# Altium project RetroPie-CM3.PrjPcb
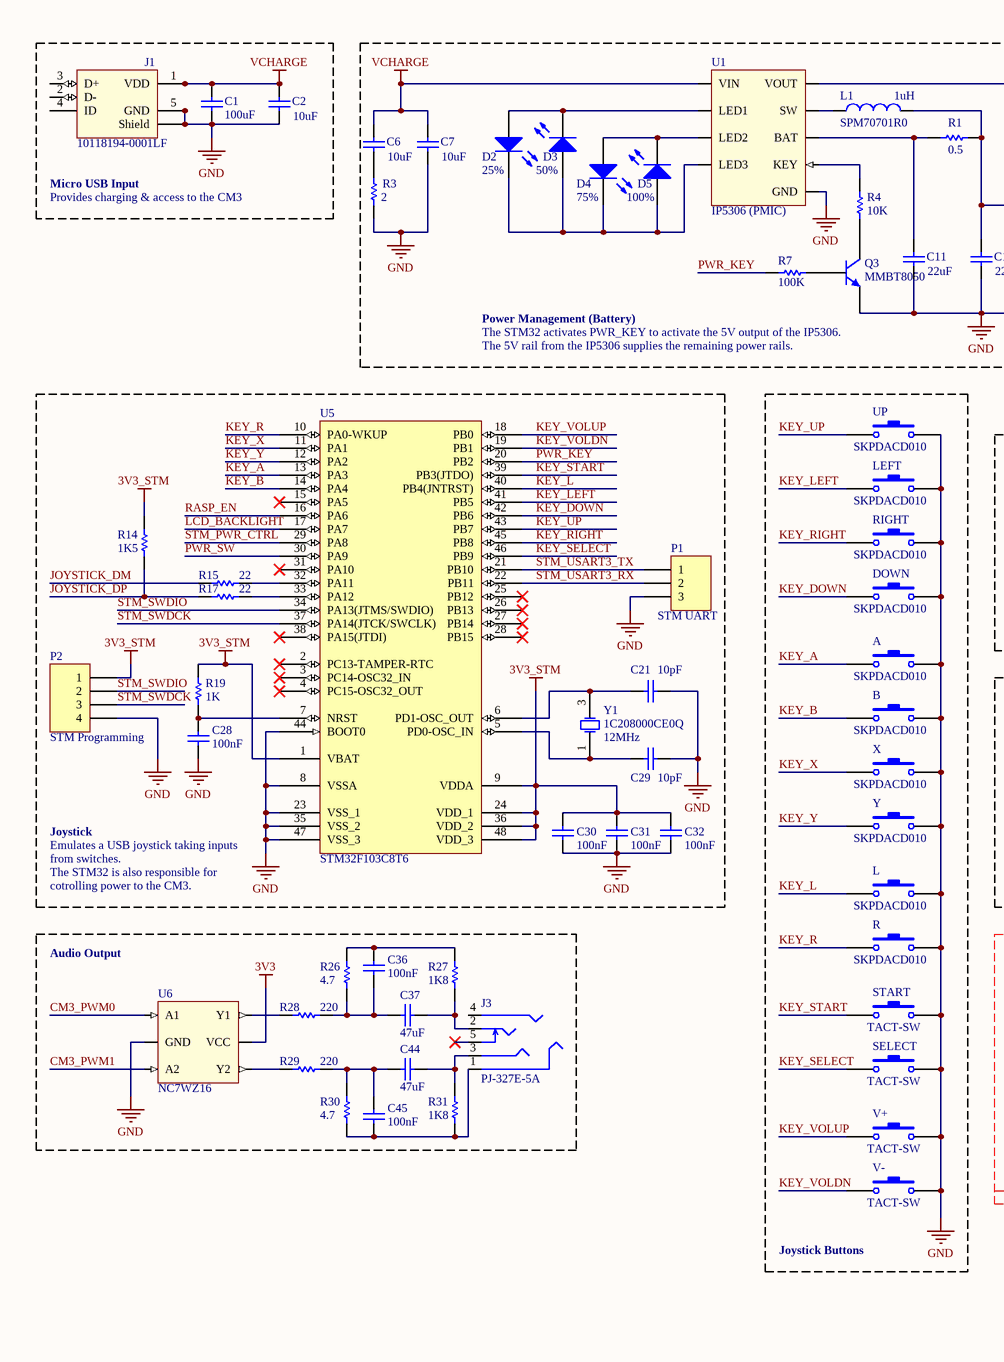
[diagram p0: RetroPie-CM3.SchDoc, left]
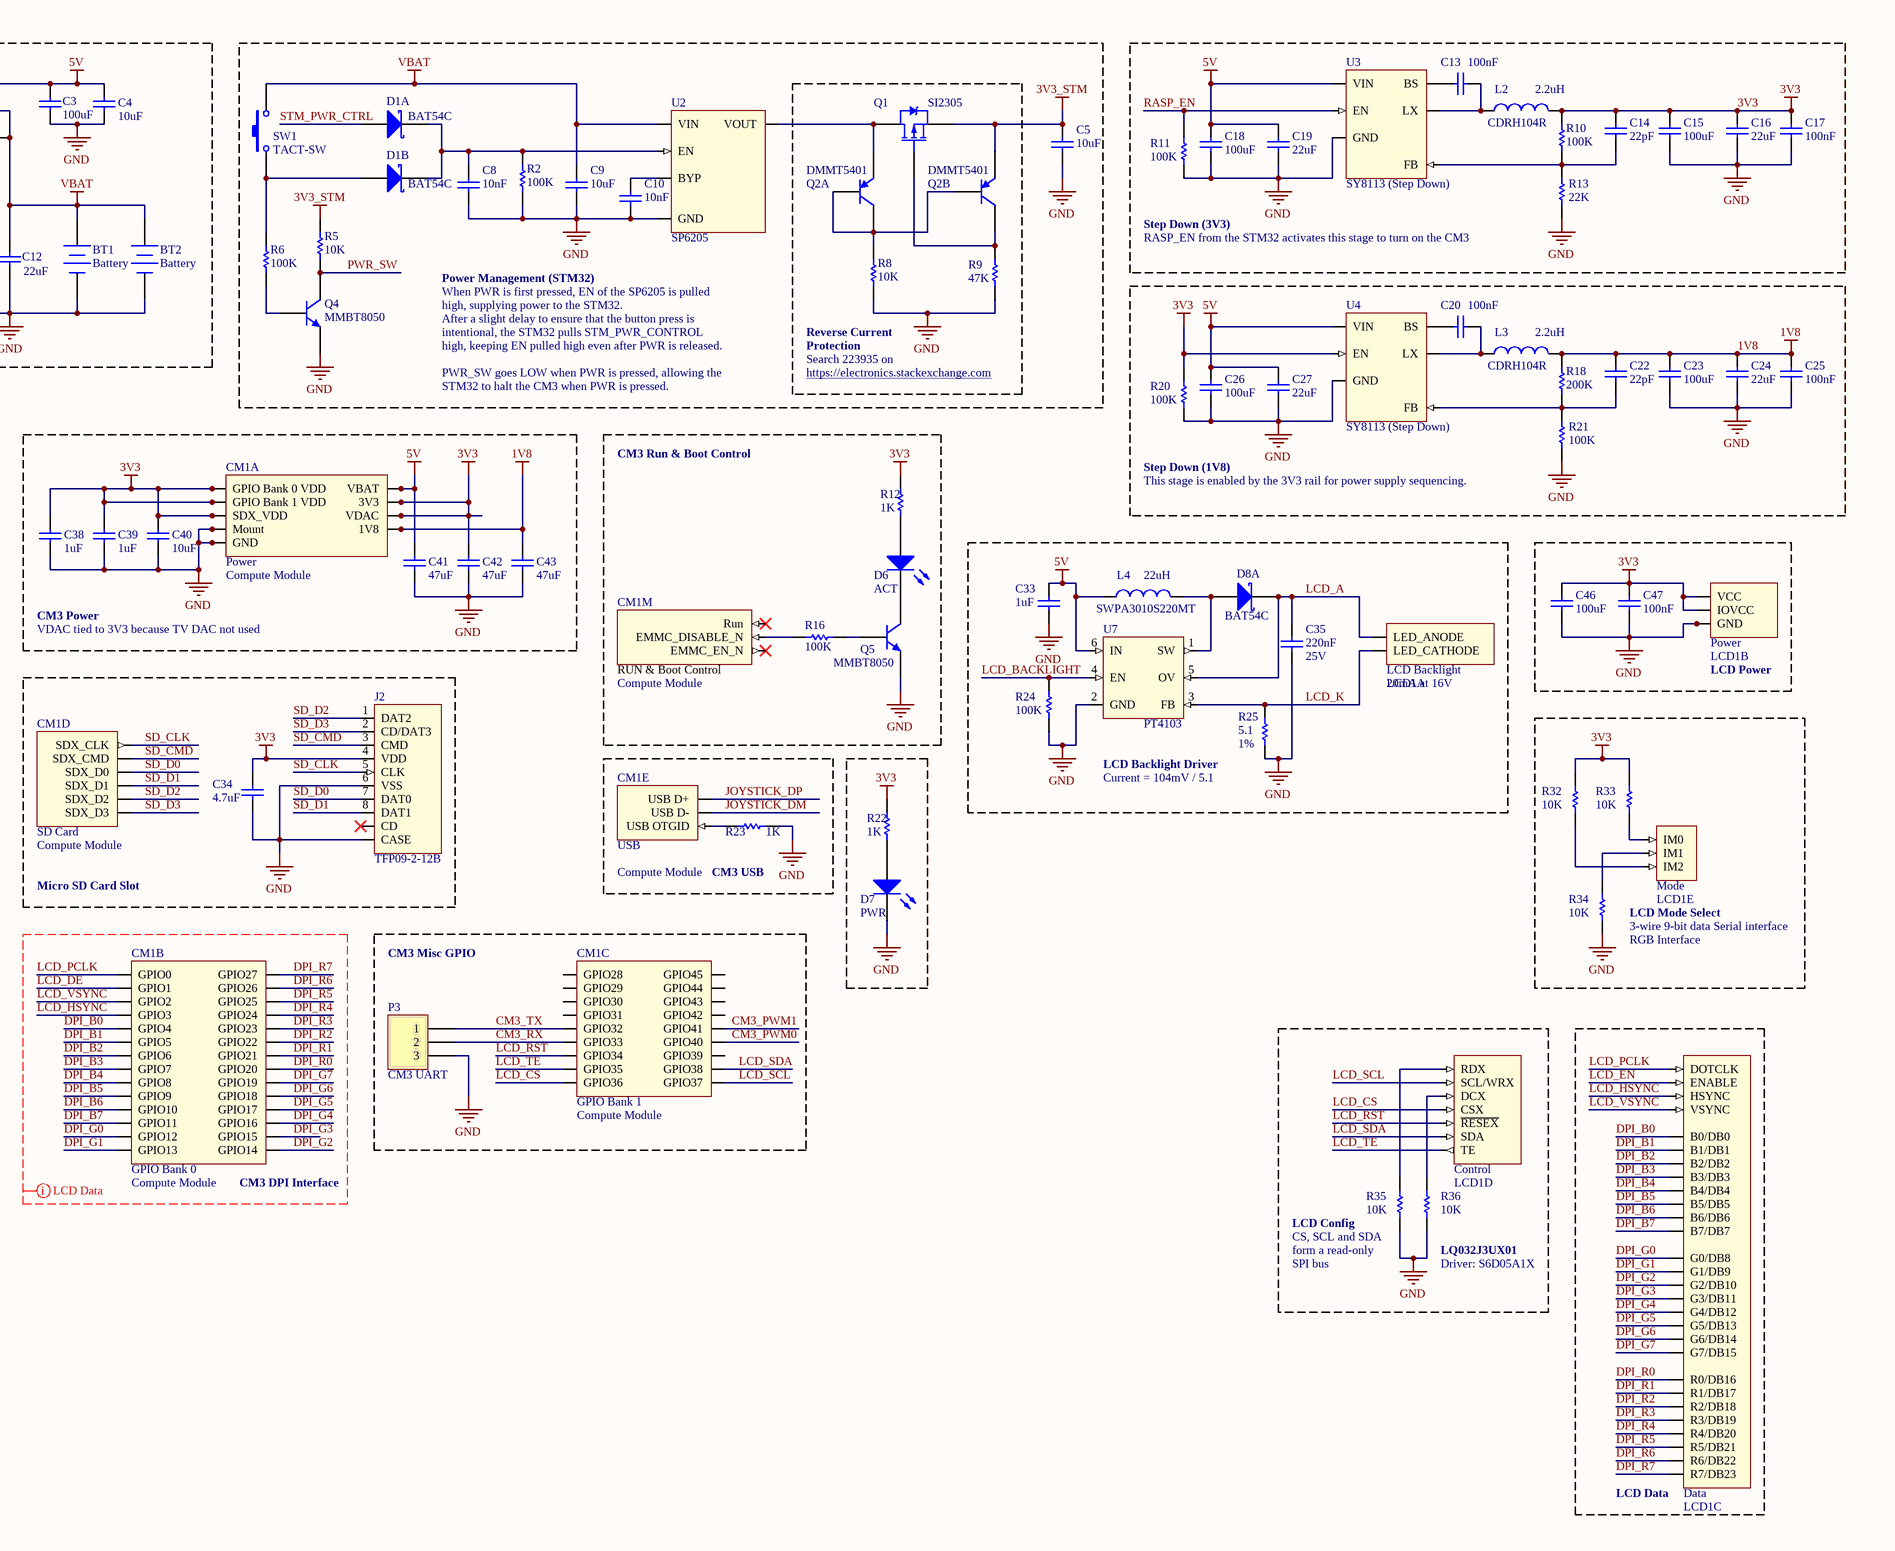
[diagram p1: RetroPie-CM3.SchDoc, right]
1 sheet, 133 parts. Net scope: global (net labels, ports and power ports of the same name join across sheets).

## Sheet RetroPie-CM3.SchDoc
size A2

### Parts
A  SKPDACD010  [ALPS_8X8X5.5]
B  SKPDACD010  [ALPS_8X8X5.5]
BT1  Battery  [BAT-2]
BT2  Battery  [BAT-2]
C1  value 100uF  [C1210_N]  (hidden comment: Cap)
C2  value 10uF  [J1-0603]  (hidden comment: Cap)
C3  value 100uF  [C1210_N]  (hidden comment: Cap)
C4  value 10uF  [J1-0603]  (hidden comment: Cap)
C5  value 10uF  [J1-0603]  (hidden comment: Cap)
C6  value 10uF  [J1-0603]  (hidden comment: Cap)
C7  value 10uF  [J1-0603]  (hidden comment: Cap)
C8  value 10nF  [J1-0603]  (hidden comment: Cap)
C9  value 10uF  [J1-0603]  (hidden comment: Cap)
C10  value 10nF  [J1-0603]  (hidden comment: Cap)
C11  value 22uF  [6-0805_N]  (hidden comment: Cap)
C12  value 22uF  [6-0805_N]  (hidden comment: Cap)
C13  value 100nF  [J1-0603]  (hidden comment: Cap)
C14  value 22pF  [6-0805_N]  (hidden comment: Cap)
C15  value 100uF  [C1210_N]  (hidden comment: Cap)
C16  value 22uF  [6-0805_N]  (hidden comment: Cap)
C17  value 100nF  [J1-0603]  (hidden comment: Cap)
C18  value 100uF  [C1210_N]  (hidden comment: Cap)
C19  value 22uF  [6-0805_N]  (hidden comment: Cap)
C20  value 100nF  [J1-0603]  (hidden comment: Cap)
C21  value 10pF  [J1-0603]  (hidden comment: Cap)
C22  value 22pF  [6-0805_N]  (hidden comment: Cap)
C23  value 100uF  [C1210_N]  (hidden comment: Cap)
C24  value 22uF  [6-0805_N]  (hidden comment: Cap)
C25  value 100nF  [J1-0603]  (hidden comment: Cap)
C26  value 100uF  [C1210_N]  (hidden comment: Cap)
C27  value 22uF  [6-0805_N]  (hidden comment: Cap)
C28  value 100nF  [J1-0603]  (hidden comment: Cap)
C29  value 10pF  [J1-0603]  (hidden comment: Cap)
C30  value 100nF  [J1-0603]  (hidden comment: Cap)
C31  value 100nF  [J1-0603]  (hidden comment: Cap)
C32  value 100nF  [J1-0603]  (hidden comment: Cap)
C33  value 1uF  [6-0805_N]  (hidden comment: Cap)
C34  value 4.7uF  [6-0805_N]  (hidden comment: Cap)
C35  value 220nF  Voltage: 25V  [6-0805_N]  (hidden comment: Cap)
C36  value 100nF  [J1-0603]  (hidden comment: Cap)
C37  value 47uF  [6-0805_N]  (hidden comment: Cap)
C38  value 1uF  [6-0805_N]  (hidden comment: Cap)
C39  value 1uF  [6-0805_N]  (hidden comment: Cap)
C40  value 10uF  [J1-0603]  (hidden comment: Cap)
C41  value 47uF  [6-0805_N]  (hidden comment: Cap)
C42  value 47uF  [6-0805_N]  (hidden comment: Cap)
C43  value 47uF  [6-0805_N]  (hidden comment: Cap)
C44  value 47uF  [6-0805_N]  (hidden comment: Cap)
C45  value 100nF  [J1-0603]  (hidden comment: Cap)
C46  value 100uF  [C1210_N]  (hidden comment: Cap)
C47  value 100nF  [J1-0603]  (hidden comment: Cap)
CM1  Compute Module  [1473005-4]  (parts A,B,C,D,E,M of 13)
D1  BAT54C  [SOT23-3N]  (parts A,B of 2)
D2  25%  [0603-LED]
D3  50%  [0603-LED]
D4  75%  [0603-LED]
D5  100%  [0603-LED]
D6  ACT  [0603-LED]
D7  PWR  [0603-LED]
D8  BAT54C  [SOT23-3N]  (part A of 2)
DOWN  SKPDACD010  [ALPS_8X8X5.5]
J1  10118194-0001LF  [10103594-0001LF]
J2  TFP09-2-12B  [TFP-09-2-12B]
J3  PJ-327E-5A  [PJ-327E]
L  SKPDACD010  [ALPS_8X8X5.5-SIDE]
L1  SPM70701R0  value 1uH  [0402-A]
L2  CDRH104R  value 2.2uH  [Generic Inductor]
L3  CDRH104R  value 2.2uH  [Generic Inductor]
L4  SWPA3010S220MT  value 22uH  [0402-A]
LCD1  LQ032J3UX01  [LQ032J3UX01]  (value not drawn)  (parts A,B,C,D,E of 5)
LEFT  SKPDACD010  [ALPS_8X8X5.5]
P1  STM UART  [HDR1X3]
P2  STM Programming  [HDR1X4]
P3  CM3 UART  [HDR1X3]
Q1  SI2305  [SOT23-3N]
Q2  DMMT5401  [SOT26A-6L]  (parts A,B of 2)
Q3  MMBT8050  [SOT23-3N]
Q4  MMBT8050  [SOT23-3N]
Q5  MMBT8050  [SOT23-3N]
R  SKPDACD010  [ALPS_8X8X5.5-SIDE]
R1  value 0.5  [1608[0603]]  (hidden comment: Res1)
R2  value 100K  [1608[0603]]  (hidden comment: Res1)
R3  value 2  [1608[0603]]  (hidden comment: Res1)
R4  value 10K  [1608[0603]]  (hidden comment: Res1)
R5  value 10K  [1608[0603]]  (hidden comment: Res1)
R6  value 100K  [1608[0603]]  (hidden comment: Res1)
R7  value 100K  [1608[0603]]  (hidden comment: Res1)
R8  value 10K  [1608[0603]]  (hidden comment: Res1)
R9  value 47K  [1608[0603]]  (hidden comment: Res1)
R10  value 100K  [1608[0603]]  (hidden comment: Res1)
R11  value 100K  [1608[0603]]  (hidden comment: Res1)
R12  value 1K  [1608[0603]]  (hidden comment: Res1)
R13  value 22K  [1608[0603]]  (hidden comment: Res1)
R14  value 1K5  [1608[0603]]  (hidden comment: Res1)
R15  value 22  [1608[0603]]  (hidden comment: Res1)
R16  value 100K  [1608[0603]]  (hidden comment: Res1)
R17  value 22  [1608[0603]]  (hidden comment: Res1)
R18  value 200K  [1608[0603]]  (hidden comment: Res1)
R19  value 1K  [1608[0603]]  (hidden comment: Res1)
R20  value 100K  [1608[0603]]  (hidden comment: Res1)
R21  value 100K  [1608[0603]]  (hidden comment: Res1)
R22  value 1K  [1608[0603]]  (hidden comment: Res1)
R23  value 1K  [1608[0603]]  (hidden comment: Res1)
R24  value 100K  [1608[0603]]  (hidden comment: Res1)
R25  value 5.1  Tolerance: 1%  [1608[0603]]  (hidden comment: Res1)
R26  value 4.7  [1608[0603]]  (hidden comment: Res1)
R27  value 1K8  [1608[0603]]  (hidden comment: Res1)
R28  value 220  [1608[0603]]  (hidden comment: Res1)
R29  value 220  [1608[0603]]  (hidden comment: Res1)
R30  value 4.7  [1608[0603]]  (hidden comment: Res1)
R31  value 1K8  [1608[0603]]  (hidden comment: Res1)
R32  value 10K  [1608[0603]]  (hidden comment: Res1)
R33  value 10K  [1608[0603]]  (hidden comment: Res1)
R34  value 10K  [1608[0603]]  (hidden comment: Res1)
R35  value 10K  [1608[0603]]  (hidden comment: Res1)
R36  value 10K  [1608[0603]]  (hidden comment: Res1)
RIGHT  SKPDACD010  [ALPS_8X8X5.5]
SELECT  TACT-SW  [TACT-SW]
START  TACT-SW  [TACT-SW]
SW1  TACT-SW  [TACT-SW]
U1  IP5306 (PMIC)  [ESOP8]
U2  SP6205  [SOT23-5AL]
U3  SY8113 (Step Down)  [SOT26A-6L]
U4  SY8113 (Step Down)  [SOT26A-6L]
U5  STM32F103C8T6  [SQFP50P900X900-48N]
U6  NC7WZ16  [SC-88]
U7  PT4103  [SOT26A-6L]
UP  SKPDACD010  [ALPS_8X8X5.5]
V+  TACT-SW  [TACT-SW]
V-  TACT-SW  [TACT-SW]
X  SKPDACD010  [ALPS_8X8X5.5]
Y  SKPDACD010  [ALPS_8X8X5.5]
Y1  1C208000CE0Q  Frequency: 12MHz  [3225]

### Blocks framed on the sheet
Power Management (Battery): BT1 BT2 C3 C4 C6 C7 C11 C12 D2-D5 L1 Q3 R1 R3 R4 R7 U1
Step Down (3V3): C13-C19 L2 R10 R11 R13 U3
Step Down (1V8): C20 C22-C27 L3 R18 R20 R21 U4
Joystick Buttons: A B DOWN L LEFT R RIGHT SELECT START UP V+ V- X Y
CM3 Run & Boot Control: CM1 D6 Q5 R12 R16
LCD Power: C46 C47 LCD1
Micro SD Card Slot: C34 CM1 J2
CM3 USB: CM1 R23
Audio Output: C36 C37 C44 C45 J3 R26-R31 U6
CM3 Misc GPIO: CM1 P3
LCD Data: LCD1

### Nets
1V8: C22.1 C23.1 C24.2 C25.1 C43.2 CM1.183(1V8) CM1.184(1V8) CM1.185(1V8) CM1.186(1V8) L3.2 R18.1
3V3: C14.1 C15.1 C16.2 C17.1 C34.2 C38.2 C39.2 C40.2 C42.2 C46.1 C47.1 CM1.4(SDX_VDD) CM1.6(SDX_VDD) CM1.39(GPIO_Bank_0_VDD) CM1.40(GPIO_Bank_0_VDD) CM1.41(GPIO_Bank_1_VDD) CM1.42(GPIO_Bank_1_VDD) CM1.189(VDAC) CM1.190(VDAC) CM1.191(3V3) CM1.192(3V3) CM1.193(3V3) CM1.194(3V3) J2.4(VDD) L2.2 LCD1.4(VCC) LCD1.5(IOVCC) R10.1 R12.2 R20.2 R22.2 R32.1 R33.1 U4.4(EN) U6.5(VCC)
3V3_STM: C5.2 C30.2 C31.2 C32.2 P2.1 Q1.2(S) Q2.5(E) R5.1 R14.1 R19.1 U5.1(VBAT) U5.9(VDDA) U5.24(VDD_1) U5.36(VDD_2) U5.48(VDD_3)
5V: C3.1 C4.2 C18.1 C19.2 C26.1 C27.2 C33.2 C41.2 CM1.197(VBAT) CM1.198(VBAT) CM1.199(VBAT) CM1.200(VBAT) L4.1 U1.8(VOUT) U3.5(VIN) U4.5(VIN) U7.6(IN)
GND: A.2 B.2 BT1.2(-) BT2.2(-) C1.2 C2.1 C3.2 C4.1 C5.1 C7.1 C8.1 C9.1 C10.1 C11.1 C12.1 C15.2 C16.1 C17.2 C18.2 C19.1 C21.1 C23.2 C24.1 C25.2 C26.2 C27.1 C28.1 C29.1 C30.1 C31.1 C32.1 C33.1 C34.1 C35.1 C38.1 C39.1 C40.1 C41.1 C42.1 C43.1 C46.2 C47.2 CM1.1(GND) CM1.7(GND) CM1.8(GND) CM1.13(GND) CM1.14(GND) CM1.19(GND) CM1.20(GND) CM1.25(GND) CM1.26(GND) CM1.31(GND) CM1.32(GND) CM1.37(GND) CM1.38(GND) CM1.43(GND) CM1.44(GND) CM1.49(GND) CM1.50(GND) CM1.55(GND) CM1.56(GND) CM1.61(GND) CM1.62(GND) CM1.67(GND) CM1.68(GND) CM1.73(GND) CM1.74(GND) CM1.79(GND) CM1.80(GND) CM1.85(GND) CM1.86(GND) CM1.91(GND) CM1.92(GND) CM1.97(GND) CM1.98(GND) CM1.103(GND) CM1.104(GND) CM1.109(GND) CM1.110(GND) CM1.115(GND) CM1.116(GND) CM1.121(GND) CM1.122(GND) CM1.127(GND) CM1.133(GND) CM1.134(GND) CM1.139(GND) CM1.140(GND) CM1.145(GND) CM1.146(GND) CM1.151(GND) CM1.152(GND) CM1.157(GND) CM1.163(GND) CM1.164(GND) CM1.169(GND) CM1.170(GND) CM1.181(GND) CM1.182(GND) CM1.187(GND) CM1.188(GND) CM1.195(GND) CM1.196(GND) CM1.203(Mount) CM1.204(Mount) D7.2(K) DOWN.2 J1.5(GND) J1.6(Shield) J1.7(Shield) J1.8(Shield) J1.9(Shield) J2.6(VSS) J2.G(CASE) L.2 LCD1.3(GND) LCD1.7(GND) LCD1.16(GND) LCD1.25(GND) LCD1.34(GND) LCD1.36(GND) LCD1.49(GND) LEFT.2 P1.3 P2.4 P3.3 Q3.2(E) Q4.2(E) Q5.2(E) R.2 R2.2 R3.1 R8.2 R9.2 R11.1 R13.1 R20.1 R21.1 R23.1 R24.2 R25.2 R34.2 R35.2 R36.2 RIGHT.2 SELECT.2 START.2 U1.9(GND) U2.2(GND) U3.2(GND) U4.2(GND) U5.8(VSSA) U5.23(VSS_1) U5.35(VSS_2) U5.44(BOOT0) U5.47(VSS_3) U6.2(GND) U7.2(GND) UP.2 V+.2 V-.2 X.2 Y.2
VBAT: BT1.1(+) BT2.1(+) C9.2 C12.2 L1.2 R1.1 SW1.2 U2.1(VIN)
VCHARGE: C1.1 C2.2 C6.2 C7.2 J1.1(VDD) U1.1(VIN)
CM3_PWM0: CM1.70(GPIO40) U6.1(A1)
CM3_PWM1: CM1.72(GPIO41) U6.3(A2)
CM3_RX: CM1.48(GPIO33) P3.2
CM3_TX: CM1.46(GPIO32) P3.1
DPI_B0: CM1.15(GPIO4) LCD1.8(B0/DB0)
DPI_B1: CM1.17(GPIO5) LCD1.9(B1/DB1)
DPI_B2: CM1.21(GPIO6) LCD1.10(B2/DB2)
DPI_B3: CM1.23(GPIO7) LCD1.11(B3/DB3)
DPI_B4: CM1.27(GPIO8) LCD1.12(B4/DB4)
DPI_B5: CM1.29(GPIO9) LCD1.13(B5/DB5)
DPI_B6: CM1.33(GPIO10) LCD1.14(B6/DB6)
DPI_B7: CM1.35(GPIO11) LCD1.15(B7/DB7)
DPI_G0: CM1.45(GPIO12) LCD1.17(G0/DB8)
DPI_G1: CM1.47(GPIO13) LCD1.18(G1/DB9)
DPI_G2: CM1.51(GPIO14) LCD1.19(G2/DB10)
DPI_G3: CM1.53(GPIO15) LCD1.20(G3/DB11)
DPI_G4: CM1.57(GPIO16) LCD1.21(G4/DB12)
DPI_G5: CM1.59(GPIO17) LCD1.22(G5/DB13)
DPI_G6: CM1.63(GPIO18) LCD1.23(G6/DB14)
DPI_G7: CM1.65(GPIO19) LCD1.24(G7/DB15)
DPI_R0: CM1.69(GPIO20) LCD1.26(R0/DB16)
DPI_R1: CM1.71(GPIO21) LCD1.27(R1/DB17)
DPI_R2: CM1.75(GPIO22) LCD1.28(R2/DB18)
DPI_R3: CM1.77(GPIO23) LCD1.29(R3/DB19)
DPI_R4: CM1.81(GPIO24) LCD1.30(R4/DB20)
DPI_R5: CM1.83(GPIO25) LCD1.31(R5/DB21)
DPI_R6: CM1.87(GPIO26) LCD1.32(R6/DB22)
DPI_R7: CM1.89(GPIO27) LCD1.33(R7/DB23)
JOYSTICK_DM: CM1.167(USB_D-) R15.1
JOYSTICK_DP: CM1.165(USB_D+) R14.2 R17.1
KEY_A: A.1 U5.13(PA3)
KEY_B: B.1 U5.14(PA4)
KEY_DOWN: DOWN.1 U5.42(PB6)
KEY_L: L.1 U5.40(PB4(JNTRST))
KEY_LEFT: LEFT.1 U5.41(PB5)
KEY_R: R.1 U5.10(PA0-WKUP)
KEY_RIGHT: RIGHT.1 U5.45(PB8)
KEY_SELECT: SELECT.1 U5.46(PB9)
KEY_START: START.1 U5.39(PB3(JTDO))
KEY_UP: U5.43(PB7) UP.1
KEY_VOLDN: U5.19(PB1) V-.1
KEY_VOLUP: U5.18(PB0) V+.1
KEY_X: U5.11(PA1) X.1
KEY_Y: U5.12(PA2) Y.1
LCD_A: C35.2 D8.3(K) LCD1.1(LED_ANODE) U7.5(OV)
LCD_BACKLIGHT: R24.1 U5.17(PA7) U7.4(EN)
LCD_CS: CM1.58(GPIO36) LCD1.43(CSX)
LCD_DE: CM1.5(GPIO1)
LCD_EN: LCD1.37(ENABLE)
LCD_HSYNC: CM1.11(GPIO3) LCD1.38(HSYNC)
LCD_K: LCD1.2(LED_CATHODE) R25.1 U7.3(FB)
LCD_PCLK: CM1.3(GPIO0) LCD1.35(DOTCLK)
LCD_RST: CM1.52(GPIO34) LCD1.44(~{RESEX})
LCD_SCL: CM1.60(GPIO37) LCD1.41(SCL/WRX)
LCD_SDA: CM1.64(GPIO38) LCD1.45(SDA)
LCD_TE: CM1.54(GPIO35) LCD1.6(TE)
LCD_VSYNC: CM1.9(GPIO2) LCD1.39(VSYNC)
PWR_KEY: R7.2 U5.20(PB2)
PWR_SW: Q4.3(C) R5.2 U5.30(PA9)
RASP_EN: R11.2 U3.4(EN) U5.16(PA6)
SD_CLK: CM1.10(SDX_CLK) J2.5(CLK)
SD_CMD: CM1.12(SDX_CMD) J2.3(CMD)
SD_D0: CM1.16(SDX_D0) J2.7(DAT0)
SD_D1: CM1.18(SDX_D1) J2.8(DAT1)
SD_D2: CM1.22(SDX_D2) J2.1(DAT2)
SD_D3: CM1.24(SDX_D3) J2.2(CD/DAT3)
STM_PWR_CTRL: D1.1(A) U5.29(PA8)
STM_SWDCK: P2.3 U5.37(PA14(JTCK/SWCLK))
STM_SWDIO: P2.2 U5.34(PA13(JTMS/SWDIO))
STM_USART3_RX: P1.2 U5.22(PB11)
STM_USART3_TX: P1.1 U5.21(PB10)
NetC6_1: C6.1 R3.2
NetC8_2: C8.2 D1.3(K) R2.1 U2.3(EN)
NetC10_2: C10.2 U2.4(BYP)
NetC11_2: C11.2 R1.2 U1.6(BAT)
NetC13_1: C13.1 L2.1 U3.6(LX)
NetC13_2: C13.2 U3.1(BS)
NetC14_2: C14.2 R10.2 R13.2 U3.3(FB)
NetC20_1: C20.1 L3.1 U4.6(LX)
NetC20_2: C20.2 U4.1(BS)
NetC21_2: C21.2 U5.6(PD1-OSC_OUT) Y1.3(OSC2)
NetC22_2: C22.2 R18.2 R21.2 U4.3(FB)
NetC28_2: C28.2 R19.2 U5.7(NRST)
NetC29_2: C29.2 U5.5(PD0-OSC_IN) Y1.1(OSC1)
NetC36_1: C36.1 C37.2 R26.1 R28.2
NetC36_2: C36.2 R26.2 R27.2
NetC37_1: C37.1 J3.2 R27.1
NetC44_1: C44.1 J3.3 R31.2
NetC44_2: C44.2 C45.2 R29.2 R30.2
NetC45_1: C45.1 J3.1 R30.1 R31.1
NetCM1_2: CM1.2(EMMC_DISABLE_N) R16.2
NetCM1_168: CM1.168(USB_OTGID) R23.2
NetD1_2: D1.2(A) R6.1 SW1.1
NetD2_1: D2.1(A) D3.2(K) U1.2(LED1)
NetD2_2: D2.2(K) D3.1(A) D4.2(K) D5.1(A) U1.4(LED3)
NetD4_1: D4.1(A) D5.2(K) U1.3(LED2)
NetD6_1: D6.1(A) R12.1
NetD6_2: D6.2(K) Q5.3(C)
NetD7_1: D7.1(A) R22.1
NetD8_1: D8.1(A) L4.2 U7.1(SW)
NetL1_1: L1.1 U1.7(SW)
NetLCD1_40: LCD1.40(RDX) R35.1
NetLCD1_42: LCD1.42(DCX) R36.1
NetLCD1_46: LCD1.46(IM0) R33.2
NetLCD1_47: LCD1.47(IM1) R34.1
NetLCD1_48: LCD1.48(IM2) R32.2
NetQ1_1: Q1.1(G) Q2.4(C) R9.1
NetQ1_3: Q1.3(D) Q2.6(E) U2.5(VOUT)
NetQ2_1: Q2.1(C) Q2.2(B) Q2.3(B) R8.1
NetQ3_1: Q3.1(B) R7.1
NetQ3_3: Q3.3(C) R4.1
NetQ4_1: Q4.1(B) R6.2
NetQ5_1: Q5.1(B) R16.1
NetR4_2: R4.2 U1.5(KEY)
NetR15_2: R15.2 U5.32(PA11)
NetR17_2: R17.2 U5.33(PA12)
NetR28_1: R28.1 U6.6(Y1)
NetR29_1: R29.1 U6.4(Y2)

Not connected (* = marked no-connect by the designer): CM1 28(GPIO28) 30(GPIO29) 34(GPIO30) 36(GPIO31) 66(GPIO39) 76(GPIO42) 78(GPIO43) 82(GPIO44) 84(GPIO45) 90(EMMC_EN_N)* 177(Run)*; J1 2(D-) 3(D+) 4(ID); J2 CD*; J3 4 5*; U5 2(PC13-TAMPER-RTC)* 3(PC14-OSC32_IN)* 4(PC15-OSC32_OUT)* 15(PA5)* 25(PB12)* 26(PB13)* 27(PB14)* 28(PB15)* 31(PA10)* 38(PA15(JTDI))*

### Layout directives
rule Matched Net Lengths [Tolerance = 100mil]; net class lcd_data: DPI_B0, DPI_B1, DPI_B2, DPI_B3, DPI_B4, DPI_B5, DPI_B6, DPI_B7, DPI_G0, DPI_G1, DPI_G2, DPI_G3, DPI_G4, DPI_G5, DPI_G6, DPI_G7, DPI_R0, DPI_R1, DPI_R2, DPI_R3, DPI_R4, DPI_R5, DPI_R6, DPI_R7, LCD_DE, LCD_HSYNC, LCD_PCLK, LCD_VSYNC

### Notes on the sheet
- Micro USB Input
- Provides charging & access to the CM3
- Power Management (STM32)
- When PWR is first pressed, EN of the SP6205 is pulled
- RASP_EN from the STM32 activates this stage to turn on the CM3
- The STM32 activates PWR_KEY to activate the 5V output of the IP5306.
- The 5V rail from the IP5306 supplies the remaining power rails.
- high, supplying power to the STM32.
- After a slight delay to ensure that the button press is
- intentional, the STM32 pulls STM_PWR_CONTROL
- high, keeping EN pulled high even after PWR is released.
- (near R8) Reverse Current
- Protection
- Search 223935 on
- PWR_SW goes LOW when PWR is pressed, allowing the
- STM32 to halt the CM3 when PWR is pressed.
- https://electronics.stackexchange.com
- (near R21) This stage is enabled by the 3V3 rail for power supply sequencing.
- CM3 Power
- VDAC tied to 3V3 because TV DAC not used
- (near LCD1) 20mA at 16V
- LCD Backlight Driver
- Joystick
- Current = 104mV / 5.1
- (near U5) Emulates a USB joystick taking inputs
- from switches.
- The STM32 is also responsible for
- cotrolling power to the CM3.
- LCD Mode Select
- (near R34) 3-wire 9-bit data Serial interface
- (near R34) RGB Interface
- (near CM1) CM3 DPI Interface
- LCD Config
- (near R35) CS, SCL and SDA
- form a read-only
- SPI bus
- LQ032J3UX01
- Driver: S6D05A1X
- (in symbol Compute Module, part A) Power
- (in symbol Compute Module, part B) GPIO Bank 0
- (in symbol Compute Module, part C) GPIO Bank 1
- (in symbol Compute Module, part D) SD Card
- (in symbol Compute Module, part E) USB
- (in symbol Compute Module, part M) RUN & Boot Control
- (in symbol LQ032J3UX01, part A) LCD Backlight
- (in symbol LQ032J3UX01, part B) Power
- (in symbol LQ032J3UX01, part C) Data
- (in symbol LQ032J3UX01, part D) Control
- (in symbol LQ032J3UX01, part E) Mode

### Library data of the parts
A B DOWN L LEFT R RIGHT UP X Y = SKPDACD010: ALPS Tacatile Switch; Published: 24-Mar-1999; LatestRevisionDate: 17-Jul-2002; LatestRevisionNote: Re-released for DXP Platform.; PackageReference: SPST-2; Publisher: Altium Limited; PackageDescription: Switch; 2 Leads; Part Number: SKPDACD010; Supplier: LCSC; ClassName: joystick_btns
BT1 BT2 = Battery: Multicell Battery; Published: 24-Mar-1999; LatestRevisionDate: 17-Jul-2002; LatestRevisionNote: Re-released for DXP Platform.; PackageReference: BAT-2; Publisher: Altium Limited; PackageDescription: Battery; 2 Leads; ClassName: pm_battery
C1 C3 C15 C18 C23 C26 C46 = Cap: Capacitor; Part Number: JMK325ABJ107MM-T; Published: 8-Jun-2000; LatestRevisionDate: 17-Jul-2002; LatestRevisionNote: Re-released for DXP Platform.; PackageReference: RAD-0.3; Publisher: Altium Limited; PackageDescription: Radial Cap, Thru-Hole; 2 Leads; 0.3 in Pin Spacing; Supplier: LCSC
  C1: ClassName: powerinput
  C3: ClassName: pm_battery
  C15 C18: ClassName: pm_3v3
  C23 C26 C46: ClassName: pm_1v8
C2 C4-C7 C9 C40 = Cap: Capacitor; Part Number: CC0603MRX5R6BB106; Published: 8-Jun-2000; LatestRevisionDate: 17-Jul-2002; LatestRevisionNote: Re-released for DXP Platform.; PackageReference: RAD-0.3; Publisher: Altium Limited; PackageDescription: Radial Cap, Thru-Hole; 2 Leads; 0.3 in Pin Spacing; Supplier: LCSC
  C2: ClassName: powerinput
  C4 C6 C7: ClassName: pm_battery
  C5 C9: ClassName: pm_stm32
C8 C10 = Cap: Capacitor; Part Number: 0603B223K500NT; Published: 8-Jun-2000; LatestRevisionDate: 17-Jul-2002; LatestRevisionNote: Re-released for DXP Platform.; PackageReference: RAD-0.3; Publisher: Altium Limited; PackageDescription: Radial Cap, Thru-Hole; 2 Leads; 0.3 in Pin Spacing; Supplier: LCSC; ClassName: pm_stm32
C11 C12 C16 C19 C24 C27 = Cap: Capacitor; Part Number: 0603F226M100NT; Published: 8-Jun-2000; LatestRevisionDate: 17-Jul-2002; LatestRevisionNote: Re-released for DXP Platform.; PackageReference: RAD-0.3; Publisher: Altium Limited; PackageDescription: Radial Cap, Thru-Hole; 2 Leads; 0.3 in Pin Spacing; Supplier: LCSC
  C11 C12: ClassName: pm_battery
  C16 C19: ClassName: pm_3v3
  C24 C27: ClassName: pm_1v8
C13 C17 C20 C25 C28 C30-C32 C36 C45 C47 = Cap: Capacitor; Part Number: C0603X104K050T; Published: 8-Jun-2000; LatestRevisionDate: 17-Jul-2002; LatestRevisionNote: Re-released for DXP Platform.; PackageReference: RAD-0.3; Publisher: Altium Limited; PackageDescription: Radial Cap, Thru-Hole; 2 Leads; 0.3 in Pin Spacing; Supplier: LCSC
  C13 C17: ClassName: pm_3v3
  C20 C25 C47: ClassName: pm_1v8
  C28 C30-C32: ClassName: joystick
  C36 C45: ClassName: audio_output
C14 C22 = Cap: Capacitor; Part Number: CL10C220JB8NNNC; Published: 8-Jun-2000; LatestRevisionDate: 17-Jul-2002; LatestRevisionNote: Re-released for DXP Platform.; PackageReference: RAD-0.3; Publisher: Altium Limited; PackageDescription: Radial Cap, Thru-Hole; 2 Leads; 0.3 in Pin Spacing; Supplier: LCSC
  C14: ClassName: pm_3v3
  C22: ClassName: pm_1v8
C21 C29 = Cap: Capacitor; Part Number: CC0603JRNPO9BN100; Published: 8-Jun-2000; LatestRevisionDate: 17-Jul-2002; LatestRevisionNote: Re-released for DXP Platform.; PackageReference: RAD-0.3; Publisher: Altium Limited; PackageDescription: Radial Cap, Thru-Hole; 2 Leads; 0.3 in Pin Spacing; Supplier: LCSC; ClassName: joystick
C33 C38 C39 = Cap: Capacitor; Part Number: CL21B105KOFNNNE; Published: 8-Jun-2000; LatestRevisionDate: 17-Jul-2002; LatestRevisionNote: Re-released for DXP Platform.; PackageReference: RAD-0.3; Publisher: Altium Limited; PackageDescription: Radial Cap, Thru-Hole; 2 Leads; 0.3 in Pin Spacing; Supplier: LCSC
  C33: ClassName: backlight_driver
C34 = Cap: Capacitor; Part Number: GRM188R61A475KE15D; Published: 8-Jun-2000; LatestRevisionDate: 17-Jul-2002; LatestRevisionNote: Re-released for DXP Platform.; PackageReference: RAD-0.3; Publisher: Altium Limited; PackageDescription: Radial Cap, Thru-Hole; 2 Leads; 0.3 in Pin Spacing; Supplier: LCSC; ClassName: uSD_slot
C35 = Cap: Capacitor; Part Number: GRM21BR71H224KA01L; Published: 8-Jun-2000; LatestRevisionDate: 17-Jul-2002; LatestRevisionNote: Re-released for DXP Platform.; PackageReference: RAD-0.3; Publisher: Altium Limited; PackageDescription: Radial Cap, Thru-Hole; 2 Leads; 0.3 in Pin Spacing; Supplier: LCSC; ClassName: backlight_driver
C37 C41-C44 = Cap: Capacitor; Part Number: 0805F476M100NT; Published: 8-Jun-2000; LatestRevisionDate: 17-Jul-2002; LatestRevisionNote: Re-released for DXP Platform.; PackageReference: RAD-0.3; Publisher: Altium Limited; PackageDescription: Radial Cap, Thru-Hole; 2 Leads; 0.3 in Pin Spacing; Supplier: LCSC
  C37 C44: ClassName: audio_output
CM1 = Compute Module: Raspberry Pi Compute Module
D1 D8 = BAT54C: Dual Schottky Diode Common Cathode; Published: 8-Jun-2000; LatestRevisionDate: 17-Jul-2002; LatestRevisionNote: Re-released for DXP Platform.; PackageVersion: Sep-1996; PackageReference: SMC; Publisher: Altium Limited; PackageDescription: DO-214-AB/SMC; 2 C-Bend Leads; Body 7.9 x 5.9 mm, inc. leads (LxW); Code_JEDEC: DO-214-AB; Part Number: BAT54C; Supplier: LCSC
  D1: ClassName: pm_stm32
  D8: ClassName: backlight_driver
D2-D5 = LED0: Typical INFRARED GaAs LED; Part Number: C2288; Published: 8-Jun-2000; LatestRevisionDate: 08-Jul-2005; LatestRevisionNote: Mech Layer 1 removed.; PackageReference: LED-0; Publisher: Altium Limited; PackageDescription: LED; 2 Leads; Supplier: LCSC; ClassName: pm_battery
D6 = LED0: Typical INFRARED GaAs LED; Part Number: C12624; Published: 8-Jun-2000; LatestRevisionDate: 08-Jul-2005; LatestRevisionNote: Mech Layer 1 removed.; PackageReference: LED-0; Publisher: Altium Limited; PackageDescription: LED; 2 Leads; Supplier: LCSC; ClassName: led_act
D7 = LED0: Typical INFRARED GaAs LED; Part Number: KT-0603R; Published: 8-Jun-2000; LatestRevisionDate: 08-Jul-2005; LatestRevisionNote: Mech Layer 1 removed.; PackageReference: LED-0; Publisher: Altium Limited; PackageDescription: LED; 2 Leads; Supplier: LCSC; ClassName: led_pwr
J1 = 10118194-0001LF_1: Conn Micro USB Type B RCP 5 POS 0.65mm Solder RA SMD 5 Terminal 1 Port T/R; MF: FCI; RS: 714-2347; Availability: Good; Price: 0.23 USD; Part Number: 10118194-0001LF; Package: DIP-4 FCI; Value: *; Supplier: LCSC; ClassName: powerinput
J2 = TFP09-2-12B: Micro SD Card Connector; Part Number: TFP09-2-12B; Supplier: LCSC; ClassName: uSD_slot
J3 = PJ-327E-5A: TRRS 3.5mm Socket SMT; Part Number: PJ-327E-5A; Supplier: LCSC; ClassName: audio_output
L1 L4 = Inductor: Code_IEC: 1005; Published: 8-Jun-2000; LatestRevisionDate: 29-May-2009; LatestRevisionNote: IPC-7351 Footprint Added.; PackageReference: 0402-A; Publisher: Altium Limited; PackageDescription: Chip Inductor; Code_JEITA: 0402
  L1: Part Number: SPM70701R0; ClassName: pm_battery
  L4: Part Number: SWPA3010S220MT; Supplier: LCSC; ClassName: backlight_driver
L2 L3 = Inductor: Part Number: CDRH104RT125NP-2R2PC; Code_IEC: 1005; Published: 8-Jun-2000; LatestRevisionDate: 29-May-2009; LatestRevisionNote: IPC-7351 Footprint Added.; PackageReference: 0402-A; Publisher: Altium Limited; PackageDescription: Chip Inductor; Code_JEITA: 0402; Supplier: LCSC
  L2: ClassName: pm_3v3
  L3: ClassName: pm_1v8
LCD1 = LQ032J3UX01: LQ032J3UX01 320*480 3.2" IPS LCD Screen; ComponentLink1Description: Source; ComponentLink1URL: https://item.taobao.com/item.htm?id=555728678341
P1 P3 = Header 3: Header, 3-Pin; LatestRevisionDate: 17-Jul-2002; LatestRevisionNote: Re-released for DXP Platform.; Publisher: Altium Limited
  P1: ClassName: joystick
P2 = Header 4: Header, 4-Pin; LatestRevisionDate: 17-Jul-2002; LatestRevisionNote: Re-released for DXP Platform.; Publisher: Altium Limited; ClassName: joystick
Q1 = SI2305: P-Channel Power MOSFET; Note: Pin 4 not drawn and electrically connected to Pin 2.; Published: 8-Jun-2000; LatestRevisionDate: 17-Jul-2002; LatestRevisionNote: Re-released for DXP Platform.; DatasheetVersion: PD-9.390D; PackageVersion: Feb-1997; PackageReference: TO-220AB; Publisher: Altium Limited; PackageDescription: TO, Thru-Hole, Vertical, Heatsink Mounted; 3 In-Line Leads; Pitch 2.54 mm; ComponentLink1Description: Manufacturer Link; ComponentLink1URL: http://www.irf.com/; Part Number: SI2305; Supplier: LCSC; ClassName: pm_stm32
Q2 = DMMT5401: Dual PNP Matched BJTs; Part Number: DMMT5401-7-F; Supplier: LCSC; ClassName: pm_stm32
Q3-Q5 = MMBT8050: NPN General Purpose Amplifier; Published: 8-Jun-2000; LatestRevisionDate: 15-Jan-2003; LatestRevisionNote: PCB Footprint 'BCY-W3/D4.7' replaced; DatasheetVersion: 1997; PackageVersion: Sep-1998; PackageReference: SOT23; Publisher: Altium Limited; PackageDescription: TO, Flat Index; 3 In-Line, Axial Leads; Body Dia. 4.5mm; Leads 0.51 x 0.48 mm (max); ComponentLink1Description: Manufacturer Link; ComponentLink1URL: http://www.fairchildsemi.com/; ComponentLink2Description: Datasheet; ComponentLink2URL: http://www.fairchildsemi.com/ds/2N%2F2N3904.pdf; Part Number: MMBT8050
  Q3: ClassName: pm_battery
  Q4: ClassName: pm_stm32
  Q5: ClassName: led_act
R1 = Res1: Resistor; Part Number: CR0603J0R5P05; Published: 8-Jun-2000; LatestRevisionDate: 17-Jul-2002; LatestRevisionNote: Re-released for DXP Platform.; PackageReference: AXIAL-0.3; Publisher: Altium Limited; PackageDescription: Axial Device, Thru-Hole; 2 Leads; 0.3 in Pin Spacing; Supplier: LCSC; ClassName: pm_battery
R2 R4-R14 R16 R18-R36 = Res1: Resistor; Published: 8-Jun-2000; LatestRevisionDate: 17-Jul-2002; LatestRevisionNote: Re-released for DXP Platform.; PackageReference: AXIAL-0.3; Publisher: Altium Limited; PackageDescription: Axial Device, Thru-Hole; 2 Leads; 0.3 in Pin Spacing
  R2 R5 R6 R8 R9: ClassName: pm_stm32
  R4 R7: ClassName: pm_battery
  R10 R11 R13: ClassName: pm_3v3
  R12 R16: ClassName: led_act
  R14 R19: ClassName: joystick
  R18 R20 R21: ClassName: pm_1v8
  R22: ClassName: led_pwr
  R23: ClassName: *
  R24 R25 R32-R36: ClassName: backlight_driver
  R26-R31: ClassName: audio_output
R3 = Res1: Resistor; Part Number: 0603WAF200KT5E; Published: 8-Jun-2000; LatestRevisionDate: 17-Jul-2002; LatestRevisionNote: Re-released for DXP Platform.; PackageReference: AXIAL-0.3; Publisher: Altium Limited; PackageDescription: Axial Device, Thru-Hole; 2 Leads; 0.3 in Pin Spacing; Supplier: LCSC; ClassName: pm_battery
R15 R17 = Res1: Resistor; Part Number: RS-03K220JT; Published: 8-Jun-2000; LatestRevisionDate: 17-Jul-2002; LatestRevisionNote: Re-released for DXP Platform.; PackageReference: AXIAL-0.3; Publisher: Altium Limited; PackageDescription: Axial Device, Thru-Hole; 2 Leads; 0.3 in Pin Spacing; Supplier: LCSC; ClassName: joystick
SELECT START SW1 V+ V- = TACT-SW: 6x6 Tacatile Switch; Published: 24-Mar-1999; LatestRevisionDate: 17-Jul-2002; LatestRevisionNote: Re-released for DXP Platform.; PackageReference: SPST-2; Publisher: Altium Limited; PackageDescription: Switch; 2 Leads
  SELECT START V+ V-: ClassName: joystick_btns
  SW1: ClassName: pm_stm32
U1 = IP5306: USB PMIC; Part Number: IP5306; Supplier: LCSC; ClassName: pm_battery
U2 = SP6205: Part Number: SP6205EM5-L-3.3/TR; ClassName: pm_stm32; Supplier: LCSC
U3 U4 = SY8113: Part Number: SY8113BADC; Supplier: LCSC
  U3: ClassName: pm_3v3
  U4: ClassName: pm_1v8
U5 = STM32F103C8T6: Medium-density performance line ARM-based 32-bit MCU with 64 or 128 KB Flash, USB, CAN, 7 timers, 2 ADCs, 9 com. interfaces; Part Number: STM32F103C8T6; Supplier: LCSC; ClassName: joystick
U6 = NC7WZ16: UHS Dual Buffer; Part Number: NC7WZ16P6X; Supplier: LCSC; ClassName: audio_output
U7 = PT4103: Constant Current LED Step-Up Converter; Part Number: PT4103B23F; Supplier: LCSC; ClassName: backlight_driver
Y1 = XTAL: Crystal Oscillator; Published: 8-Jun-2000; LatestRevisionDate: 17-Jul-2002; LatestRevisionNote: Re-released for DXP Platform.; PackageReference: R38; Publisher: Altium Limited; PackageDescription: Crystal, Thru-Hole; 2 Leads; Body 3.1 x 8.2 mm (Dia.xH); Part Number: 1C208000CE0Q; Supplier: LCSC; ClassName: joystick